# Altium schematic sheet 05_MCU.SchDoc: =TitleParameter
size A3; Organization: ASISGUARD; Address1: Kemalpasa, Kemalpasa Cd. No:290 D:292H, 35060 Bornova/Izmir/Turkey; SheetNumber: 5; SheetTotal: 8
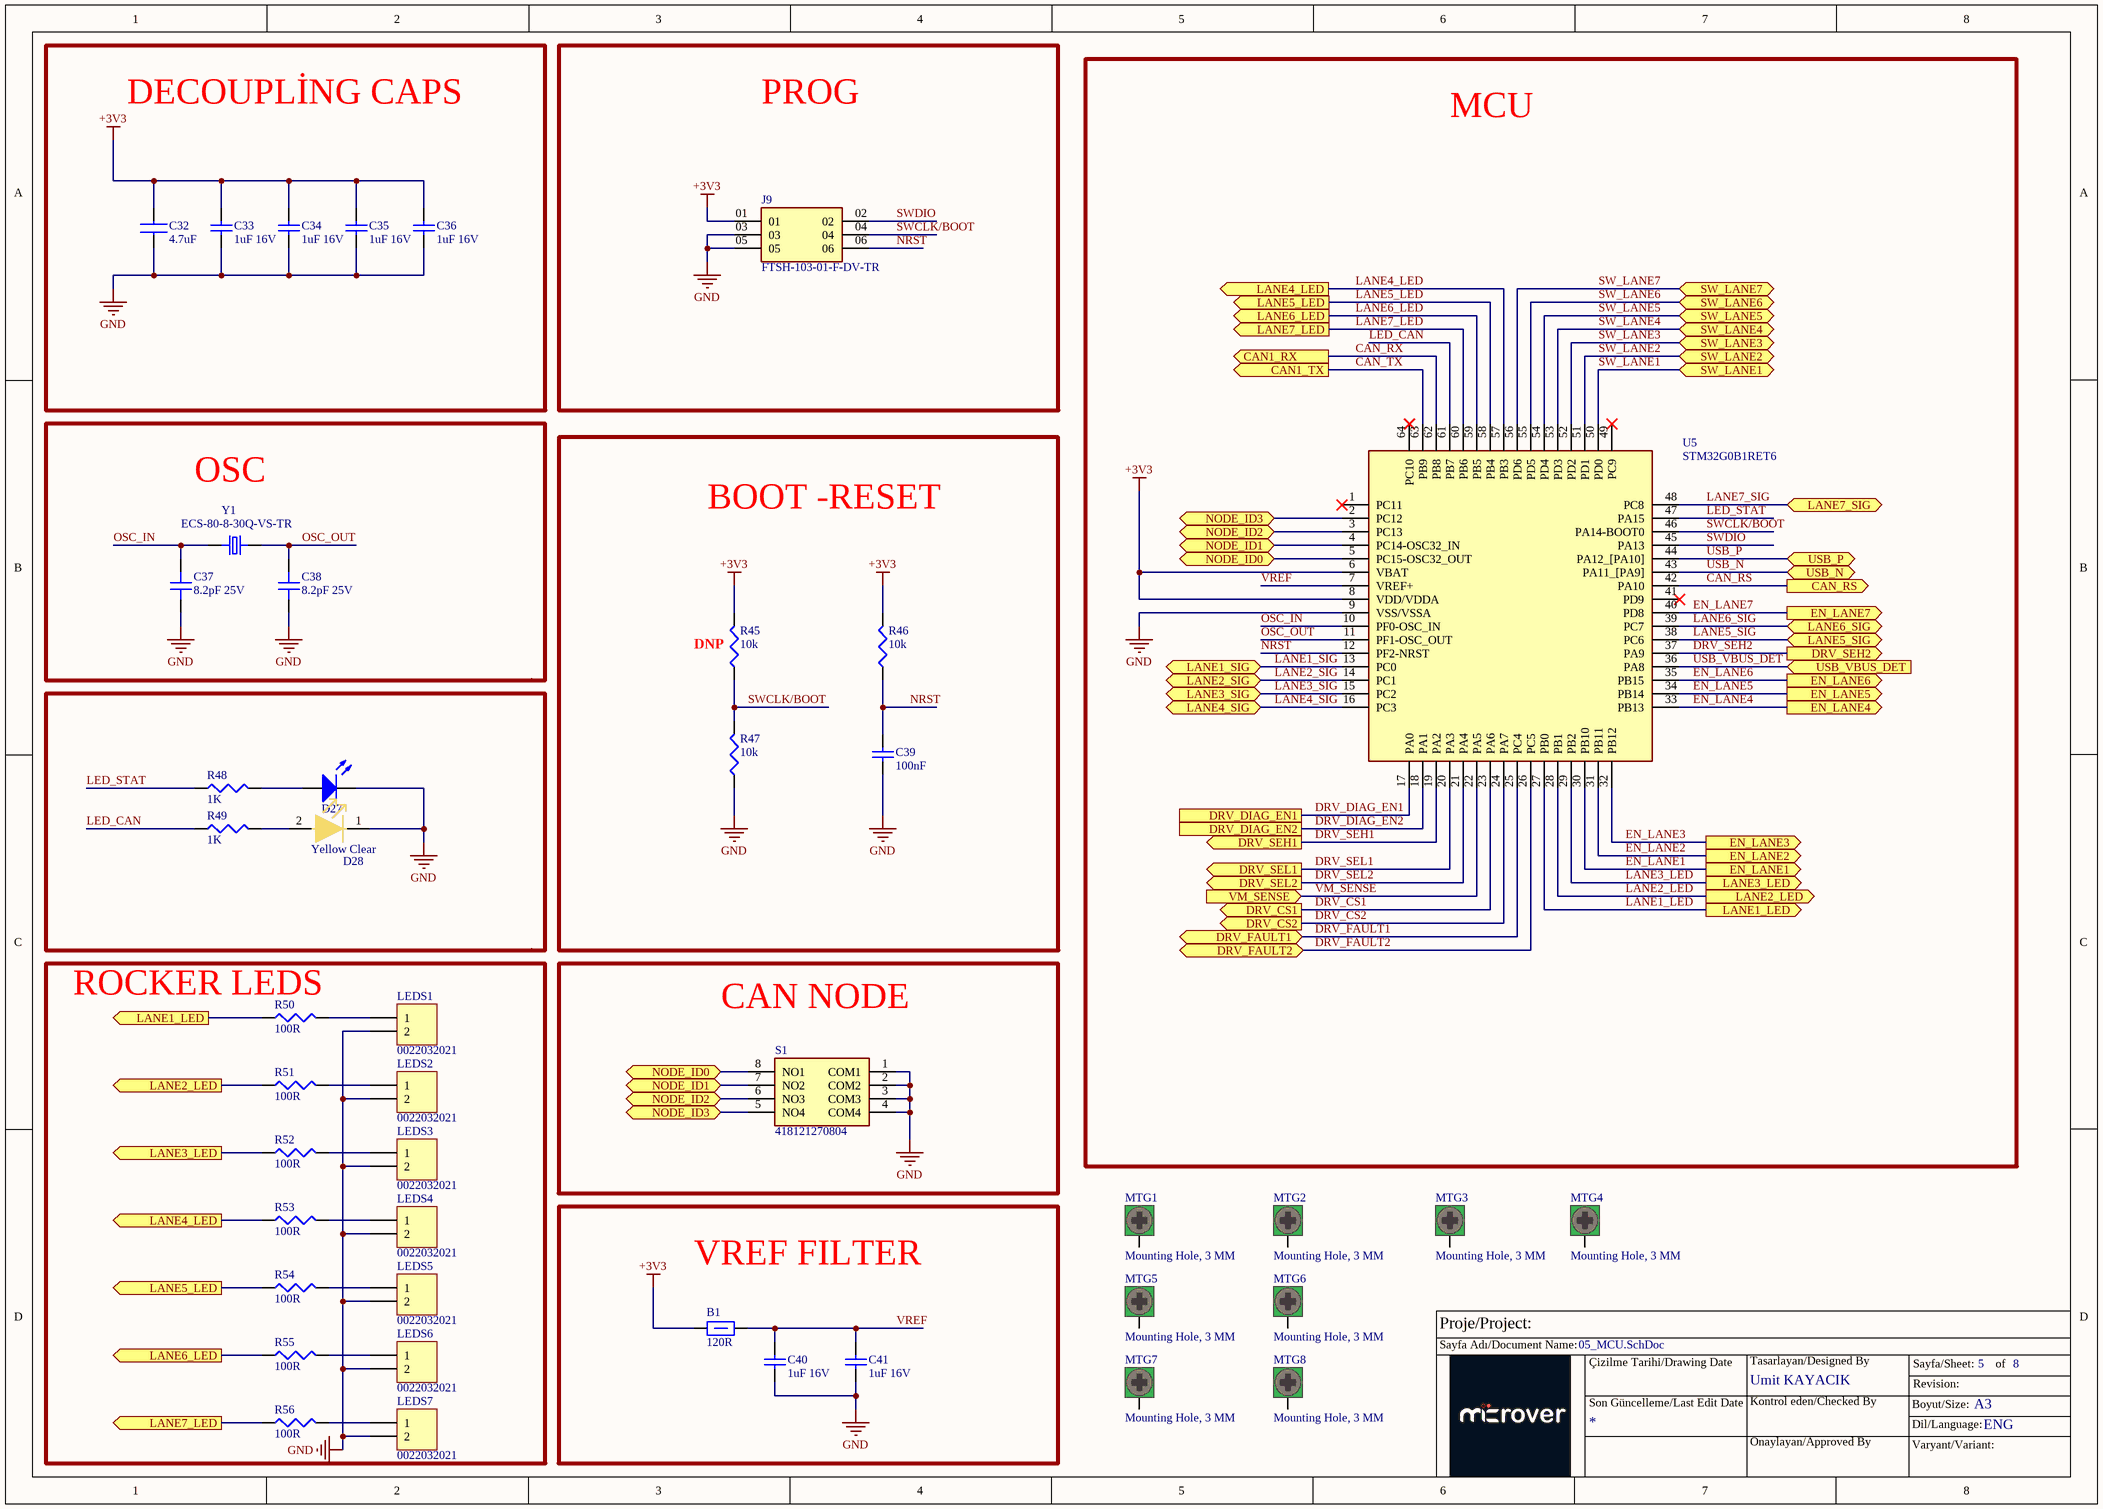
[diagram p0: 05_MCU.SchDoc]

## Parts
B1  value 120R  [F0603]  (hidden comment: BEAD FERRITE 120R 1LN SMD 0603)
C32  4.7uF  [CAP0603]
C33  value 1uF 16V  [SMC0603]  (hidden comment: CAP CER 1UF 16V X7R 0603)
C34  value 1uF 16V  [SMC0603]  (hidden comment: CAP CER 1UF 16V X7R 0603)
C35  value 1uF 16V  [SMC0603]  (hidden comment: CAP CER 1UF 16V X7R 0603)
C36  value 1uF 16V  [SMC0603]  (hidden comment: CAP CER 1UF 16V X7R 0603)
C37  8.2pF 25V  [0402_C]
C38  8.2pF 25V  [0402_C]
C39  value 100nF  [CAP0603]  (hidden comment: 100nF 25V)
C40  value 1uF 16V  [SMC0603]  (hidden comment: CAP CER 1UF 16V X7R 0603)
C41  value 1uF 16V  [SMC0603]  (hidden comment: CAP CER 1UF 16V X7R 0603)
D27  LED GREEN  [LED0805]  (value not drawn)
D28  Color: Yellow Clear  [Lite-On_Yellow_0603]  (hidden comment: LED YELLOW CLEAR SMD)
J9  FTSH-103-01-F-DV-TR  [SAMTEC_FTSH-103-01-F-DV-TR]
LEDS1  0022032021  [THD 1x2p. male straight]
LEDS2  0022032021  [THD 1x2p. male straight]
LEDS3  0022032021  [THD 1x2p. male straight]
LEDS4  0022032021  [THD 1x2p. male straight]
LEDS5  0022032021  [THD 1x2p. male straight]
LEDS6  0022032021  [THD 1x2p. male straight]
LEDS7  0022032021  [THD 1x2p. male straight]
MTG1  Mounting Hole, 3 MM  [M3 Mounting Hole]
MTG2  Mounting Hole, 3 MM  [M3 Mounting Hole]
MTG3  Mounting Hole, 3 MM  [M3 Mounting Hole]
MTG4  Mounting Hole, 3 MM  [M3 Mounting Hole]
MTG5  Mounting Hole, 3 MM  [M3 Mounting Hole]
MTG6  Mounting Hole, 3 MM  [M3 Mounting Hole]
MTG7  Mounting Hole, 3 MM  [M3 Mounting Hole]
MTG8  Mounting Hole, 3 MM  [M3 Mounting Hole]
R45  value 10k  [SMR0603]  (hidden comment: RES 10K OHM 1% 1/10W 0603)
R46  value 10k  [SMR0603]  (hidden comment: RES 10K OHM 1% 1/10W 0603)
R47  value 10k  [SMR0603]  (hidden comment: RES 10K OHM 1% 1/10W 0603)
R48  1K  [R 0603(1608)]
R49  1K  [R 0603(1608)]
R50  value 100R  [SMR0603]  (hidden comment: RES 100 OHM 1% 1/10W 0603)
R51  value 100R  [SMR0603]  (hidden comment: RES 100 OHM 1% 1/10W 0603)
R52  value 100R  [SMR0603]  (hidden comment: RES 100 OHM 1% 1/10W 0603)
R53  value 100R  [SMR0603]  (hidden comment: RES 100 OHM 1% 1/10W 0603)
R54  value 100R  [SMR0603]  (hidden comment: RES 100 OHM 1% 1/10W 0603)
R55  value 100R  [SMR0603]  (hidden comment: RES 100 OHM 1% 1/10W 0603)
R56  value 100R  [SMR0603]  (hidden comment: RES 100 OHM 1% 1/10W 0603)
S1  418121270804  [418121270804]
U5  STM32G0B1RET6  [QFP50P1200X1200X160-64N]
Y1  ECS-80-8-30Q-VS-TR  [XTAL_ECS-80-8-30Q-VS-TR]

## Blocks framed on the sheet
DECOUPLİNG CAPS: C32-C36
PROG: J9
MCU: U5
OSC: C37 C38 Y1
BOOT -RESET: C39 R45-R47
ROCKER LEDS: LEDS1-LEDS7 R50-R56
CAN NODE: S1
VREF FILTER: B1 C40 C41

## Ports
CAN1_RX (out), CAN1_TX (out), CAN_RS (out), DRV_CS1 (out), DRV_CS2 (out), DRV_DIAG_EN1, DRV_DIAG_EN2, DRV_FAULT1 (bidir), DRV_FAULT2 (bidir), DRV_SEH1 (out), DRV_SEH2 (out), DRV_SEL1 (out), DRV_SEL2 (out), EN_LANE1 (out), EN_LANE2 (out), EN_LANE3 (out), EN_LANE4 (out), EN_LANE5 (out), EN_LANE6 (out), EN_LANE7 (out), LANE1_LED (out), LANE1_SIG (bidir), LANE2_LED (out), LANE2_SIG (bidir), LANE3_LED (out), LANE3_SIG (bidir), LANE4_LED (out), LANE4_SIG (bidir), LANE5_LED (out), LANE5_SIG (bidir), LANE6_LED (out), LANE6_SIG (bidir), LANE7_LED (out), LANE7_SIG (bidir), NODE_ID0 (bidir), NODE_ID1 (bidir), NODE_ID2 (bidir), NODE_ID3 (bidir), SW_LANE1 (bidir), SW_LANE2 (bidir), SW_LANE3 (bidir), SW_LANE4 (bidir), SW_LANE5 (bidir), SW_LANE6 (bidir), SW_LANE7 (bidir), USB_N (bidir), USB_P (bidir), USB_VBUS_DET (in), VM_SENSE (in)

## Nets
+3V3: B1.1 C32.2 C33.2 C34.2 C35.2 C36.2 J9.01 R45.2 R46.2 U5.6(VBAT) U5.8(VDD/VDDA)
GND: C32.1 C33.1 C34.1 C35.1 C36.1 C37.1 C38.1 C39.1 C40.1 C41.1 D27.1(K) D28.1(C) J9.03 J9.05 LEDS1.2 LEDS2.2 LEDS3.2 LEDS4.2 LEDS5.2 LEDS6.2 LEDS7.2 R47.1 S1.1(COM1) S1.2(COM2) S1.3(COM3) S1.4(COM4) U5.9(VSS/VSSA)
CAN_RS: U5.42(PA10) ; port CAN_RS
CAN_RX: U5.62(PB8) ; port CAN1_RX
CAN_TX: U5.63(PB9) ; port CAN1_TX
DRV_CS1: U5.23(PA6) ; port DRV_CS1
DRV_CS2: U5.24(PA7) ; port DRV_CS2
DRV_DIAG_EN1: U5.17(PA0) ; port DRV_DIAG_EN1
DRV_DIAG_EN2: U5.18(PA1) ; port DRV_DIAG_EN2
DRV_FAULT1: U5.25(PC4) ; port DRV_FAULT1
DRV_FAULT2: U5.26(PC5) ; port DRV_FAULT2
DRV_SEH1: U5.19(PA2) ; port DRV_SEH1
DRV_SEH2: U5.37(PA9) ; port DRV_SEH2
DRV_SEL1: U5.20(PA3) ; port DRV_SEL1
DRV_SEL2: U5.21(PA4) ; port DRV_SEL2
EN_LANE1: U5.30(PB10) ; port EN_LANE1
EN_LANE2: U5.31(PB11) ; port EN_LANE2
EN_LANE3: U5.32(PB12) ; port EN_LANE3
EN_LANE4: U5.33(PB13) ; port EN_LANE4
EN_LANE5: U5.34(PB14) ; port EN_LANE5
EN_LANE6: U5.35(PB15) ; port EN_LANE6
EN_LANE7: U5.40(PD8) ; port EN_LANE7
LANE1_LED: R50.1 U5.27(PB0) ; port LANE1_LED
LANE1_SIG: U5.13(PC0) ; port LANE1_SIG
LANE2_LED: R51.1 U5.28(PB1) ; port LANE2_LED
LANE2_SIG: U5.14(PC1) ; port LANE2_SIG
LANE3_LED: R52.1 U5.29(PB2) ; port LANE3_LED
LANE3_SIG: U5.15(PC2) ; port LANE3_SIG
LANE4_LED: R53.1 U5.57(PB3) ; port LANE4_LED
LANE4_SIG: U5.16(PC3) ; port LANE4_SIG
LANE5_LED: R54.1 U5.58(PB4) ; port LANE5_LED
LANE5_SIG: U5.38(PC6) ; port LANE5_SIG
LANE6_LED: R55.1 U5.59(PB5) ; port LANE6_LED
LANE6_SIG: U5.39(PC7) ; port LANE6_SIG
LANE7_LED: R56.1 U5.60(PB6) ; port LANE7_LED
LANE7_SIG: U5.48(PC8) ; port LANE7_SIG
LED_CAN: R49.1 U5.61(PB7)
LED_STAT: R48.1 U5.47(PA15)
NODE_ID0: S1.8(NO1) U5.5(PC15-OSC32_OUT) ; port NODE_ID0
NODE_ID1: S1.7(NO2) U5.4(PC14-OSC32_IN) ; port NODE_ID1
NODE_ID2: S1.6(NO3) U5.3(PC13) ; port NODE_ID2
NODE_ID3: S1.5(NO4) U5.2(PC12) ; port NODE_ID3
NRST: C39.2 J9.06 R46.1 U5.12(PF2-NRST)
OSC_IN: C37.2 U5.10(PF0-OSC_IN) Y1.1(IN/OUT)
OSC_OUT: C38.2 U5.11(PF1-OSC_OUT) Y1.2(OUT/IN)
SW_LANE1: U5.50(PD0) ; port SW_LANE1
SW_LANE2: U5.51(PD1) ; port SW_LANE2
SW_LANE3: U5.52(PD2) ; port SW_LANE3
SW_LANE4: U5.53(PD3) ; port SW_LANE4
SW_LANE5: U5.54(PD4) ; port SW_LANE5
SW_LANE6: U5.55(PD5) ; port SW_LANE6
SW_LANE7: U5.56(PD6) ; port SW_LANE7
SWCLK/BOOT: J9.04 R45.1 R47.2 U5.46(PA14-BOOT0)
SWDIO: J9.02 U5.45(PA13)
USB_N: U5.43(PA11_[PA9]) ; port USB_N
USB_P: U5.44(PA12_[PA10]) ; port USB_P
USB_VBUS_DET: U5.36(PA8) ; port USB_VBUS_DET
VM_SENSE: U5.22(PA5) ; port VM_SENSE
VREF: B1.2 C40.2 C41.2 U5.7(VREF+)
NetD27_2: D27.2(A) R48.2
NetD28_2: D28.2(A) R49.2
NetLEDS1_1: LEDS1.1 R50.2
NetLEDS2_1: LEDS2.1 R51.2
NetLEDS3_1: LEDS3.1 R52.2
NetLEDS4_1: LEDS4.1 R53.2
NetLEDS5_1: LEDS5.1 R54.2
NetLEDS6_1: LEDS6.1 R55.2
NetLEDS7_1: LEDS7.1 R56.2

Not connected (* = marked no-connect by the designer): MTG1 0; MTG2 0; MTG3 0; MTG4 0; MTG5 0; MTG6 0; MTG7 0; MTG8 0; U5 1(PC11)* 41(PD9)* 49(PC9)* 64(PC10)*

## Notes on the sheet
- (near R45) DNP
- Proje/Project:
- Sayfa Adı/Document Name:
- Çizilme Tarihi/Drawing Date
- Umit KAYACIK
- Tasarlayan/Designed By
- Sayfa/Sheet:
- Revision:
- of
- Son Güncelleme/Last Edit Date
- Kontrol eden/Checked By
- Onaylayan/Approved By
- Boyut/Size:
- Varyant/Variant:
- Dil/Language:
- A3
- ENG

## Library data of the parts
B1 = BEAD FERRITE 120R 1LN SMD 0603: Manufacturer: MURATA; Manufacturer Part Name: BLM18PG121SN1D; Code: 3030007; Family: BEAD; Supplier: Digikey; Supplier No: 490-1037-2-ND; Package Reference: F1206
C32 = CAP0603_4.7uF_10V: 4.7 µF ±20% 10V Ceramic Capacitor X5R 0603 (1608 Metric); Manufacturer Name: Murata Electronics; Manufacturer Part Number: GRM185R61A475ME11D; Datasheet Link: https://componentsearchengine.com/Datasheets/1/06031A100FAT2A.pdf; Height: 0.9mm
C33-C36 C40 C41 = CAP0603_1UF_16V: 1 µF ±10% 16V Ceramic Capacitor X7R 0603 (1608 Metric); Manufacturer Part Number: CGA3E1X7R1C105K080AC; Order Code: DIGI: 445-12539-2-ND
C37 C38 = GMC04CG8R2J25NT: CAP0402 COG 8.2PF 5% 25V; Manifacturer: Cal-Chip Electronics, Inc.; Supplier: Digi; 4713-GMC04CG8R2J25NTDKR-ND
C39 = CAP0603_100nF: 0.1 µF ±10% 50V Ceramic Capacitor X7R 0603 (1608 Metric); Manufacturer Part Number: CL10B104KA8NNNC; LCSC Part Number: C1590
D27 = LED0805_GREEN: Green 570nm LED Indication - Discrete 2.1V 0805 (2012 Metric); Manufacturer Part Number: QTLP630C4TR; Manufacturer: Everlight Electronics Co Ltd; Color: Red; ComponentLink1Description: Manufacturer URL; ComponentLink2Description: Datasheet; ComponentLink1URL: http://www.we-online.com; PackageReference: 0805_A; ComponentLink2URL: http://katalog.we-online.com/led/datasheet/150080RS75000.pdf
D28 = LTST-C191KSKT: Yellow 591nm LED Indication - Discrete 2.1V 0603 (1608 Metric); Order Code: DIGI: 160-1448-2-ND; Manufacturer Part Number: LTST-C191KSKT
J9 = FTSH-103-01-F-DV-TR: Connector Header Surface Mount 6 position 0.050" (1.27mm); Manufacturer: Samtec Inc.; Supplier: SAM13919DKR-ND
LEDS1-LEDS7 = Header 2: CONN HEADER VERT 2POS 2.54MM; Manufacturer: Molex; Manufacturer Part Number: 0022032021; Supplier Part Number: WM4000-ND
MTG1-MTG8 = MTG3MM_8
R45-R47 = RES0603_10K_%1: 10 kOhms ±1% 0.1W, 1/10W Chip Resistor 0603 (1608 Metric) Moisture Resistant Thick Film; Manufacturer Part Number: RC0603FR-0710KL; Order Code: Digi: 311-10.0KHRTR-ND; Sirius Stock Code: *; LCSC Part Number: C98220; LCSC Manufacturer Part Number: RC0603FR-0710KL
R48 R49 = Res3_9: RES SMD 1K OHM 1% 1/10W 0603; Manufacturer: Yageo; Manufacturer Part Number: RC0603FR-071KL; Resistance: 1kR; Temperature Coefficient: 100ppm/°C; Power Rating: 100mW; Voltage Rating: 50V; ComponentLink1URL: https://datasheet.ciiva.com/11819/0900766b80c66297-11819477.pdf?src-supplier=RSComponents; ComponentLink1Description: https://datasheet.ciiva.com/11819/0900766b80c66297-11819477.pdf?src-supplier=RSComponents; ComponentLink2URL: https://datasheet.ciiva.com/12666/pyu-rc0402-51-rohs-l-6-r-12666741.pdf?src-supplier=Mouser; ComponentLink2Description: https://datasheet.ciiva.com/12666/pyu-rc0402-51-rohs-l-6-r-12666741.pdf?src-supplier=Mouser; ComponentLink3URL: https://datasheet.ciiva.com/17063/pyu-rc0402-51-rohs-l-6-r-17063193.pdf?src-supplier=Future+Electronics; ComponentLink3Description: https://datasheet.ciiva.com/17063/pyu-rc0402-51-rohs-l-6-r-17063193.pdf?src-supplier=Future+Electronics; ComponentLink4URL: https://datasheet.ciiva.com/22747/1018594-22747513.pdf?src-supplier=Element14; ComponentLink4Description: https://datasheet.ciiva.com/22747/1018594-22747513.pdf?src-supplier=Element14; ComponentLink5URL: https://datasheet.ciiva.com/7849/1018594-7849869.pdf?src-supplier=Element14; ComponentLink5Description: https://datasheet.ciiva.com/7849/1018594-7849869.pdf?src-supplier=Element14; ComponentLink6URL: https://datasheet.ciiva.com/7983/1018594-7983502.pdf?src-supplier=Element14; ComponentLink6Description: https://datasheet.ciiva.com/7983/1018594-7983502.pdf?src-supplier=Element14; ComponentLink7URL: https://datasheet.ciiva.com/7849/1018594-7849871.pdf?src-supplier=Element14; ComponentLink7Description: https://datasheet.ciiva.com/7849/1018594-7849871.pdf?src-supplier=Element14; ComponentLink8URL: https://datasheet.ciiva.com/11808/0900766b80c66297-11808195.pdf?src-supplier=RSComponents; ComponentLink8Description: https://datasheet.ciiva.com/11808/0900766b80c66297-11808195.pdf?src-supplier=RSComponents; ComponentLink9URL: https://datasheet.ciiva.com/2452/pyu-rc0402-51-rohs-l-6-2452608.pdf?src-supplier=Digi-Key; ComponentLink9Description: https://datasheet.ciiva.com/2452/pyu-rc0402-51-rohs-l-6-2452608.pdf?src-supplier=Digi-Key; ComponentLink10URL: https://datasheet.ciiva.com/2452/pyu-r-int-thick-7-2452609.pdf?src-supplier=Digi-Key; ComponentLink10Description: https://datasheet.ciiva.com/2452/pyu-r-int-thick-7-2452609.pdf?src-supplier=Digi-Key; ComponentLink11URL: https://datasheet.ciiva.com/2452/pyu-r-int-thick-7-2452610.pdf?src-supplier=Digi-Key; ComponentLink11Description: https://datasheet.ciiva.com/2452/pyu-r-int-thick-7-2452610.pdf?src-supplier=Digi-Key; ComponentLink12URL: https://datasheet.ciiva.com/28386/pyu-rc0402-51-rohs-l-6-28386633.pdf?src-supplier=Avnet+Europe; ComponentLink12Description: https://datasheet.ciiva.com/28386/pyu-rc0402-51-rohs-l-6-28386633.pdf?src-supplier=Avnet+Europe; ComponentLink13URL: https://datasheet.ciiva.com/22747/1018594-22747515.pdf?src-supplier=Element14; ComponentLink13Description: https://datasheet.ciiva.com/22747/1018594-22747515.pdf?src-supplier=Element14; ComponentLink14URL: https://datasheet.ciiva.com/7983/1018594-7983535.pdf?src-supplier=Element14; ComponentLink14Description: https://datasheet.ciiva.com/7983/1018594-7983535.pdf?src-supplier=Element14; ComponentLink15URL: https://datasheet.ciiva.com/8896/pyu-rc0402-51-rohs-l-6-8896201.pdf?src-supplier=Avnet; ComponentLink15Description: https://datasheet.ciiva.com/8896/pyu-rc0402-51-rohs-l-6-8896201.pdf?src-supplier=Avnet; ComponentLink16URL: https://datasheet.ciiva.com/15189/getdatasheetpartid-326379-15189533.pdf?src-supplier=Verical; ComponentLink16Description: https://datasheet.ciiva.com/15189/getdatasheetpartid-326379-15189533.pdf?src-supplier=Verical; Supplier 1: Digi-Key; Supplier Part Number 1: 311-1.00KHRCT-ND; RoHS: Yes; Category: Chip SMD Resistors; Stock 1: 11977983; Pricing 1: 1=0,10000, 10=0,02400, 100=0,00970, 1000=0,00436, 2500=0,00378 (USD); Case/Package: 0603; Contact Plating: Tin,Matte; Case Code (Imperial): 0603; Case Code (Metric): 1608; Size Code: 0603; Min Operating Temperature: -55°C; Max Operating Temperature: 155°C; Tolerance: 1%; Resistor Type: Thick Film; Packaging: Tape and Reel; Termination: SMD/SMT; Features: Moisture Resistant; Series: RC; Max Power Dissipation: 100mW; Number of Terminations: 2; Technology: THICK FILM; Resistance Tolerance: 1%; Construction: Rectangular; Length: 1.6mm; Height: 0.45mm; Depth: 0.8mm; Radiation Hardening: No; REACH SVHC: No SVHC; Lead Free: Lead Free; Military Standard: Not; RoHS Compliant: Yes
R50-R56 = RES0603_100R_%1_1: 100 Ohms ±1% 0.1W, 1/10W Chip Resistor 0603 (1608 Metric) Moisture Resistant Thick Film; Manufacturer Part Number: RC0603FR-07100RL; Order Code: Digi: 311-100HRTR-ND; Sirius Stock Code: *; LCSC Part Number: C105588; LCSC Manufacturer Part Number: RC0603FR-07100RL
S1 = 418121270804: Dip Switch, 0.025A, 24Vdc, 4 Pos, Smd Rohs Compliant: Yes |Wurth Elektronik 418121270804; Manufacturer: Wurth Electronics; Supplier 1: Digikey; Manufacturer Part Number: 418121270804; RoHS: Yes; Category: DIP Switches; Stock 1: 5600; Pricing 1: 800=1.456 (USD); ComponentLink1URL: https://katalog.we-online.de/em/datasheet/4181212708xx.pdf?src-supplier=Digikey; ComponentLink1Description: https://katalog.we-online.de/em/datasheet/4181212708xx.pdf?src-supplier=Digikey; Supplier Part Number 1: 732-6963-2-ND
U5 = STM32G0B1RET6: ARM® Cortex®-M0+ STM32G0 Microcontroller IC 32-Bit 64MHz 512KB (512K x 8) FLASH 64-LQFP (10x10); Supplier: 497-STM32G0B1RET6-ND; MPN: STM32G0B1RET6
Y1 = ECS-80-8-30Q-VS-TR: CRYSTAL 8.0000MHZ 8PF SMD; Manufacturer: ESC Inc.; Supplier: Digi; XC3144DKR-ND